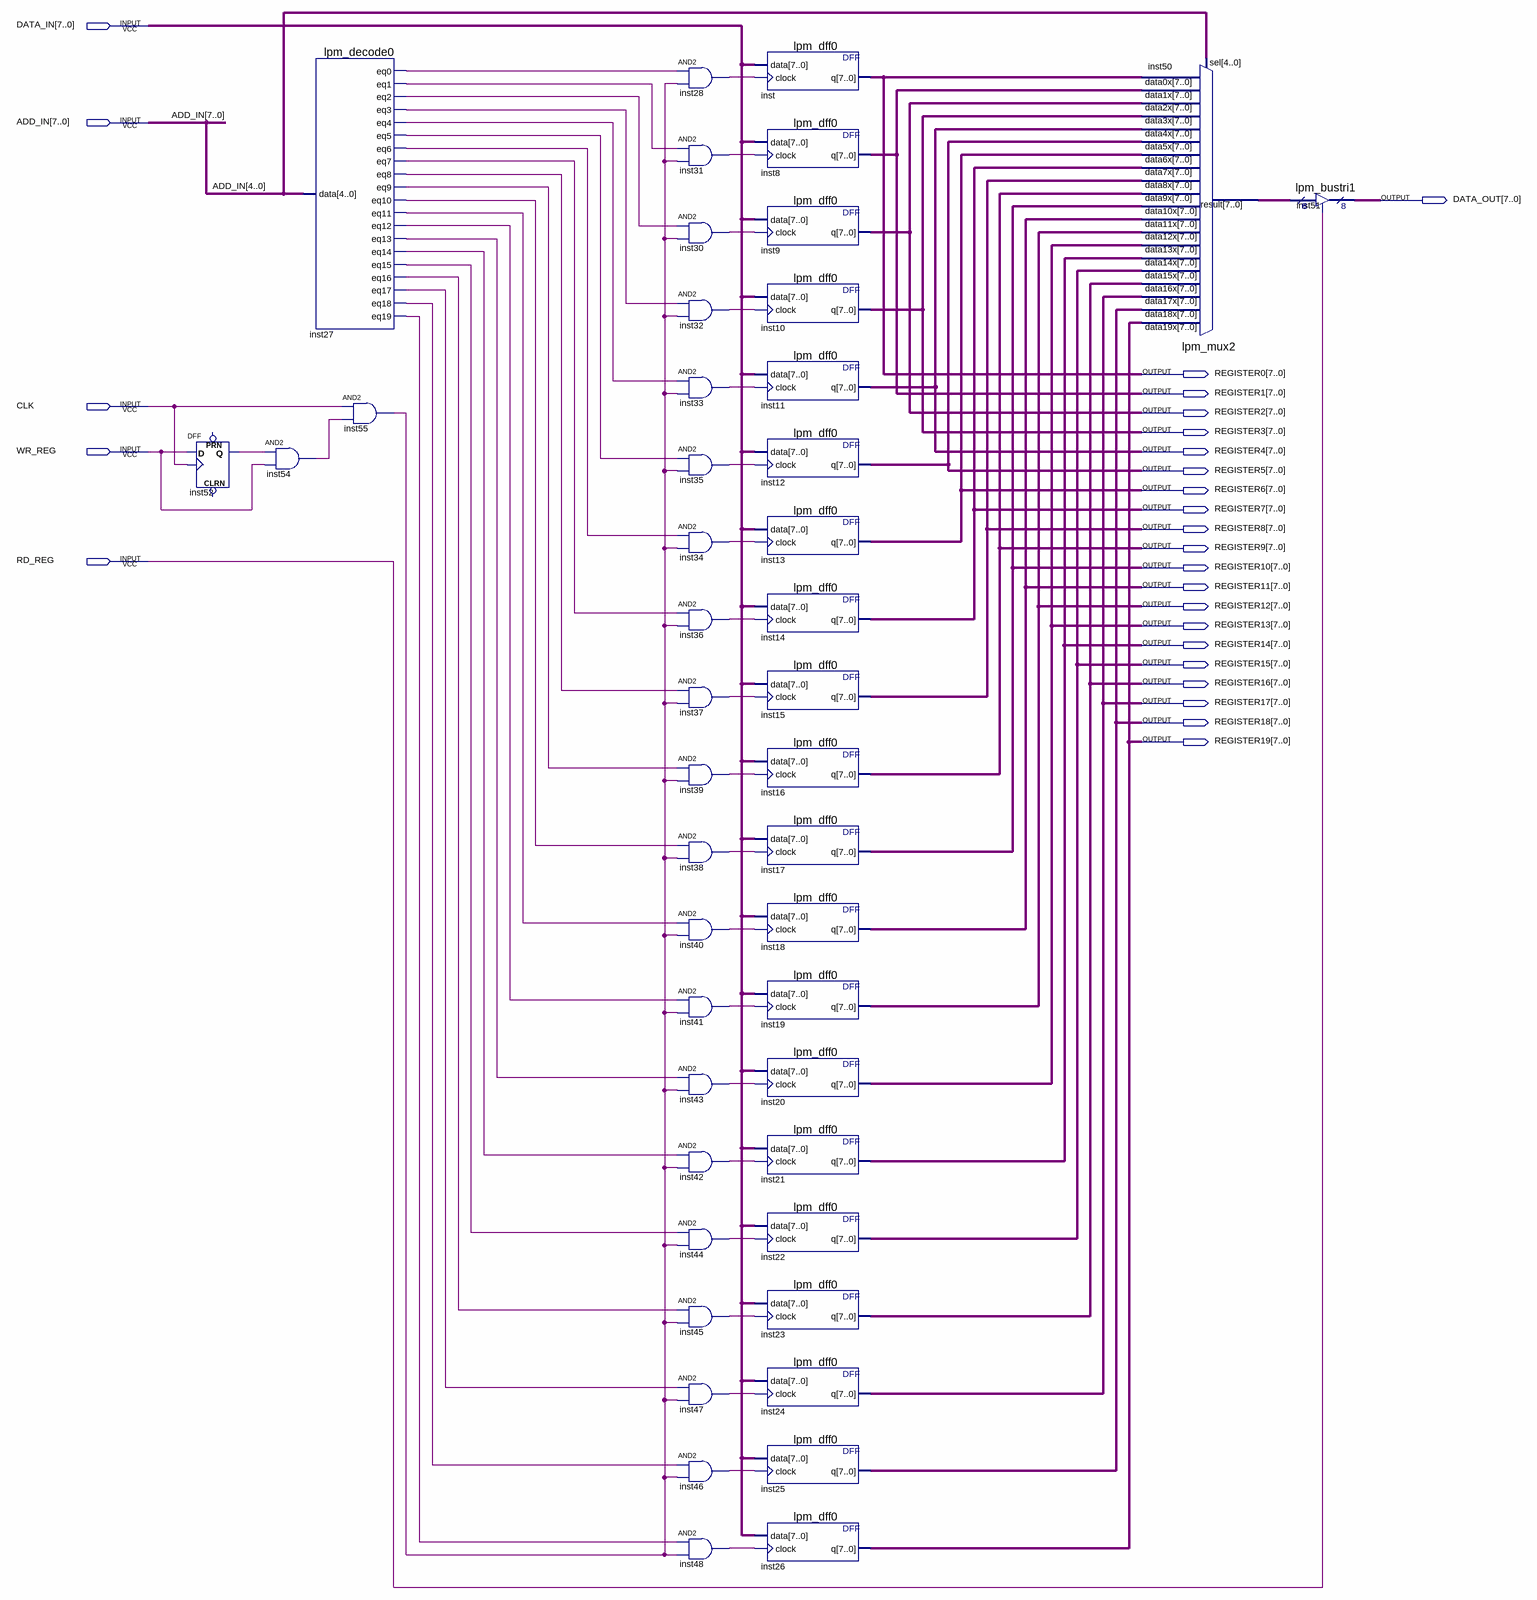
[diagram p0: schematic sheet]
// Quartus schematic REGISTERS.bdf as structural Verilog: 46 symbols, 26 pins
module REGISTERS (
  input  [7:0] DATA_IN,
  input  [7:0] ADD_IN,
  input  CLK,
  input  WR_REG,
  input  RD_REG,
  output [7:0] DATA_OUT,
  output [7:0] REGISTER0,
  output [7:0] REGISTER1,
  output [7:0] REGISTER2,
  output [7:0] REGISTER3,
  output [7:0] REGISTER4,
  output [7:0] REGISTER5,
  output [7:0] REGISTER6,
  output [7:0] REGISTER7,
  output [7:0] REGISTER8,
  output [7:0] REGISTER9,
  output [7:0] REGISTER10,
  output [7:0] REGISTER11,
  output [7:0] REGISTER12,
  output [7:0] REGISTER13,
  output [7:0] REGISTER14,
  output [7:0] REGISTER15,
  output [7:0] REGISTER16,
  output [7:0] REGISTER17,
  output [7:0] REGISTER18,
  output [7:0] REGISTER19
);

  wire inst27_eq0, inst27_eq1, inst27_eq2, inst27_eq3, inst27_eq4, inst27_eq5, inst27_eq6, inst27_eq7,
       inst27_eq8, inst27_eq9, inst27_eq10, inst27_eq11, inst27_eq12, inst27_eq13, inst27_eq14, inst27_eq15,
       inst27_eq16, inst27_eq17, inst27_eq18, inst27_eq19, inst28_out, inst30_out, inst31_out, inst32_out,
       inst33_out, inst34_out, inst35_out, inst36_out, inst37_out, inst38_out, inst39_out, inst40_out,
       inst41_out, inst42_out, inst43_out, inst44_out, inst45_out, inst46_out, inst47_out, inst48_out,
       inst52_q, inst54_out, inst55_out;
  wire [7:0] inst50_result;

  DFF inst52 (.CLK(CLK), .D(WR_REG), .Q(inst52_q));  // open: CLRN, PRN
  and inst54 (inst54_out, inst52_q, WR_REG);
  lpm_decode0 inst27 (
    .data(ADD_IN[4:0]), .eq0(inst27_eq0), .eq1(inst27_eq1), .eq2(inst27_eq2), .eq3(inst27_eq3),
    .eq4(inst27_eq4), .eq5(inst27_eq5), .eq6(inst27_eq6), .eq7(inst27_eq7), .eq8(inst27_eq8),
    .eq9(inst27_eq9), .eq10(inst27_eq10), .eq11(inst27_eq11), .eq12(inst27_eq12), .eq13(inst27_eq13),
    .eq14(inst27_eq14), .eq15(inst27_eq15), .eq16(inst27_eq16), .eq17(inst27_eq17), .eq18(inst27_eq18),
    .eq19(inst27_eq19));
  and inst55 (inst55_out, CLK, inst54_out);
  and inst28 (inst28_out, inst27_eq0, inst55_out);
  and inst31 (inst31_out, inst27_eq1, inst55_out);
  and inst30 (inst30_out, inst27_eq2, inst55_out);
  and inst32 (inst32_out, inst27_eq3, inst55_out);
  and inst33 (inst33_out, inst27_eq4, inst55_out);
  and inst35 (inst35_out, inst27_eq5, inst55_out);
  and inst34 (inst34_out, inst27_eq6, inst55_out);
  and inst36 (inst36_out, inst27_eq7, inst55_out);
  and inst37 (inst37_out, inst27_eq8, inst55_out);
  and inst39 (inst39_out, inst27_eq9, inst55_out);
  and inst38 (inst38_out, inst27_eq10, inst55_out);
  and inst40 (inst40_out, inst27_eq11, inst55_out);
  and inst41 (inst41_out, inst27_eq12, inst55_out);
  and inst43 (inst43_out, inst27_eq13, inst55_out);
  and inst42 (inst42_out, inst27_eq14, inst55_out);
  and inst44 (inst44_out, inst27_eq15, inst55_out);
  and inst45 (inst45_out, inst27_eq16, inst55_out);
  and inst47 (inst47_out, inst27_eq17, inst55_out);
  and inst46 (inst46_out, inst27_eq18, inst55_out);
  and inst48 (inst48_out, inst27_eq19, inst55_out);
  lpm_dff0 inst (.data(DATA_IN), .clock(inst28_out), .q(REGISTER0));
  lpm_dff0 inst8 (.data(DATA_IN), .clock(inst31_out), .q(REGISTER1));
  lpm_dff0 inst9 (.data(DATA_IN), .clock(inst30_out), .q(REGISTER2));
  lpm_dff0 inst10 (.data(DATA_IN), .clock(inst32_out), .q(REGISTER3));
  lpm_dff0 inst11 (.data(DATA_IN), .clock(inst33_out), .q(REGISTER4));
  lpm_dff0 inst12 (.data(DATA_IN), .clock(inst35_out), .q(REGISTER5));
  lpm_dff0 inst13 (.data(DATA_IN), .clock(inst34_out), .q(REGISTER6));
  lpm_dff0 inst14 (.data(DATA_IN), .clock(inst36_out), .q(REGISTER7));
  lpm_dff0 inst15 (.data(DATA_IN), .clock(inst37_out), .q(REGISTER8));
  lpm_dff0 inst16 (.data(DATA_IN), .clock(inst39_out), .q(REGISTER9));
  lpm_dff0 inst17 (.data(DATA_IN), .clock(inst38_out), .q(REGISTER10));
  lpm_dff0 inst18 (.data(DATA_IN), .clock(inst40_out), .q(REGISTER11));
  lpm_dff0 inst19 (.data(DATA_IN), .clock(inst41_out), .q(REGISTER12));
  lpm_dff0 inst20 (.data(DATA_IN), .clock(inst43_out), .q(REGISTER13));
  lpm_dff0 inst21 (.data(DATA_IN), .clock(inst42_out), .q(REGISTER14));
  lpm_dff0 inst22 (.data(DATA_IN), .clock(inst44_out), .q(REGISTER15));
  lpm_dff0 inst23 (.data(DATA_IN), .clock(inst45_out), .q(REGISTER16));
  lpm_dff0 inst24 (.data(DATA_IN), .clock(inst47_out), .q(REGISTER17));
  lpm_dff0 inst25 (.data(DATA_IN), .clock(inst46_out), .q(REGISTER18));
  lpm_dff0 inst26 (.data(DATA_IN), .clock(inst48_out), .q(REGISTER19));
  lpm_mux2 inst50 (
    .data19x(REGISTER19), .data18x(REGISTER18), .data17x(REGISTER17), .data16x(REGISTER16),
    .data15x(REGISTER15), .data14x(REGISTER14), .data13x(REGISTER13), .data12x(REGISTER12),
    .data11x(REGISTER11), .data10x(REGISTER10), .data9x(REGISTER9), .data8x(REGISTER8), .data7x(REGISTER7),
    .data6x(REGISTER6), .data5x(REGISTER5), .data4x(REGISTER4), .data3x(REGISTER3), .data2x(REGISTER2),
    .data1x(REGISTER1), .data0x(REGISTER0), .sel(ADD_IN[4:0]), .result(inst50_result));
  lpm_bustri1 inst51 (.enabledt(RD_REG), .data(inst50_result), .tridata(DATA_OUT));
endmodule
